# EasyEDA Pro project 主控底板.eprj, schematic TMS320F28335_v2

## Sheets
1 coreboard: Board Name: TMS320F28335; Create Date: 2025-04-28; Page Name: coreboard; Project Name: 主控底板; Schematic Name: TMS320F28335; Update Date: 2025-06-09; Company: 嘉立创EDA; Page Size: A4; Version: V1.0
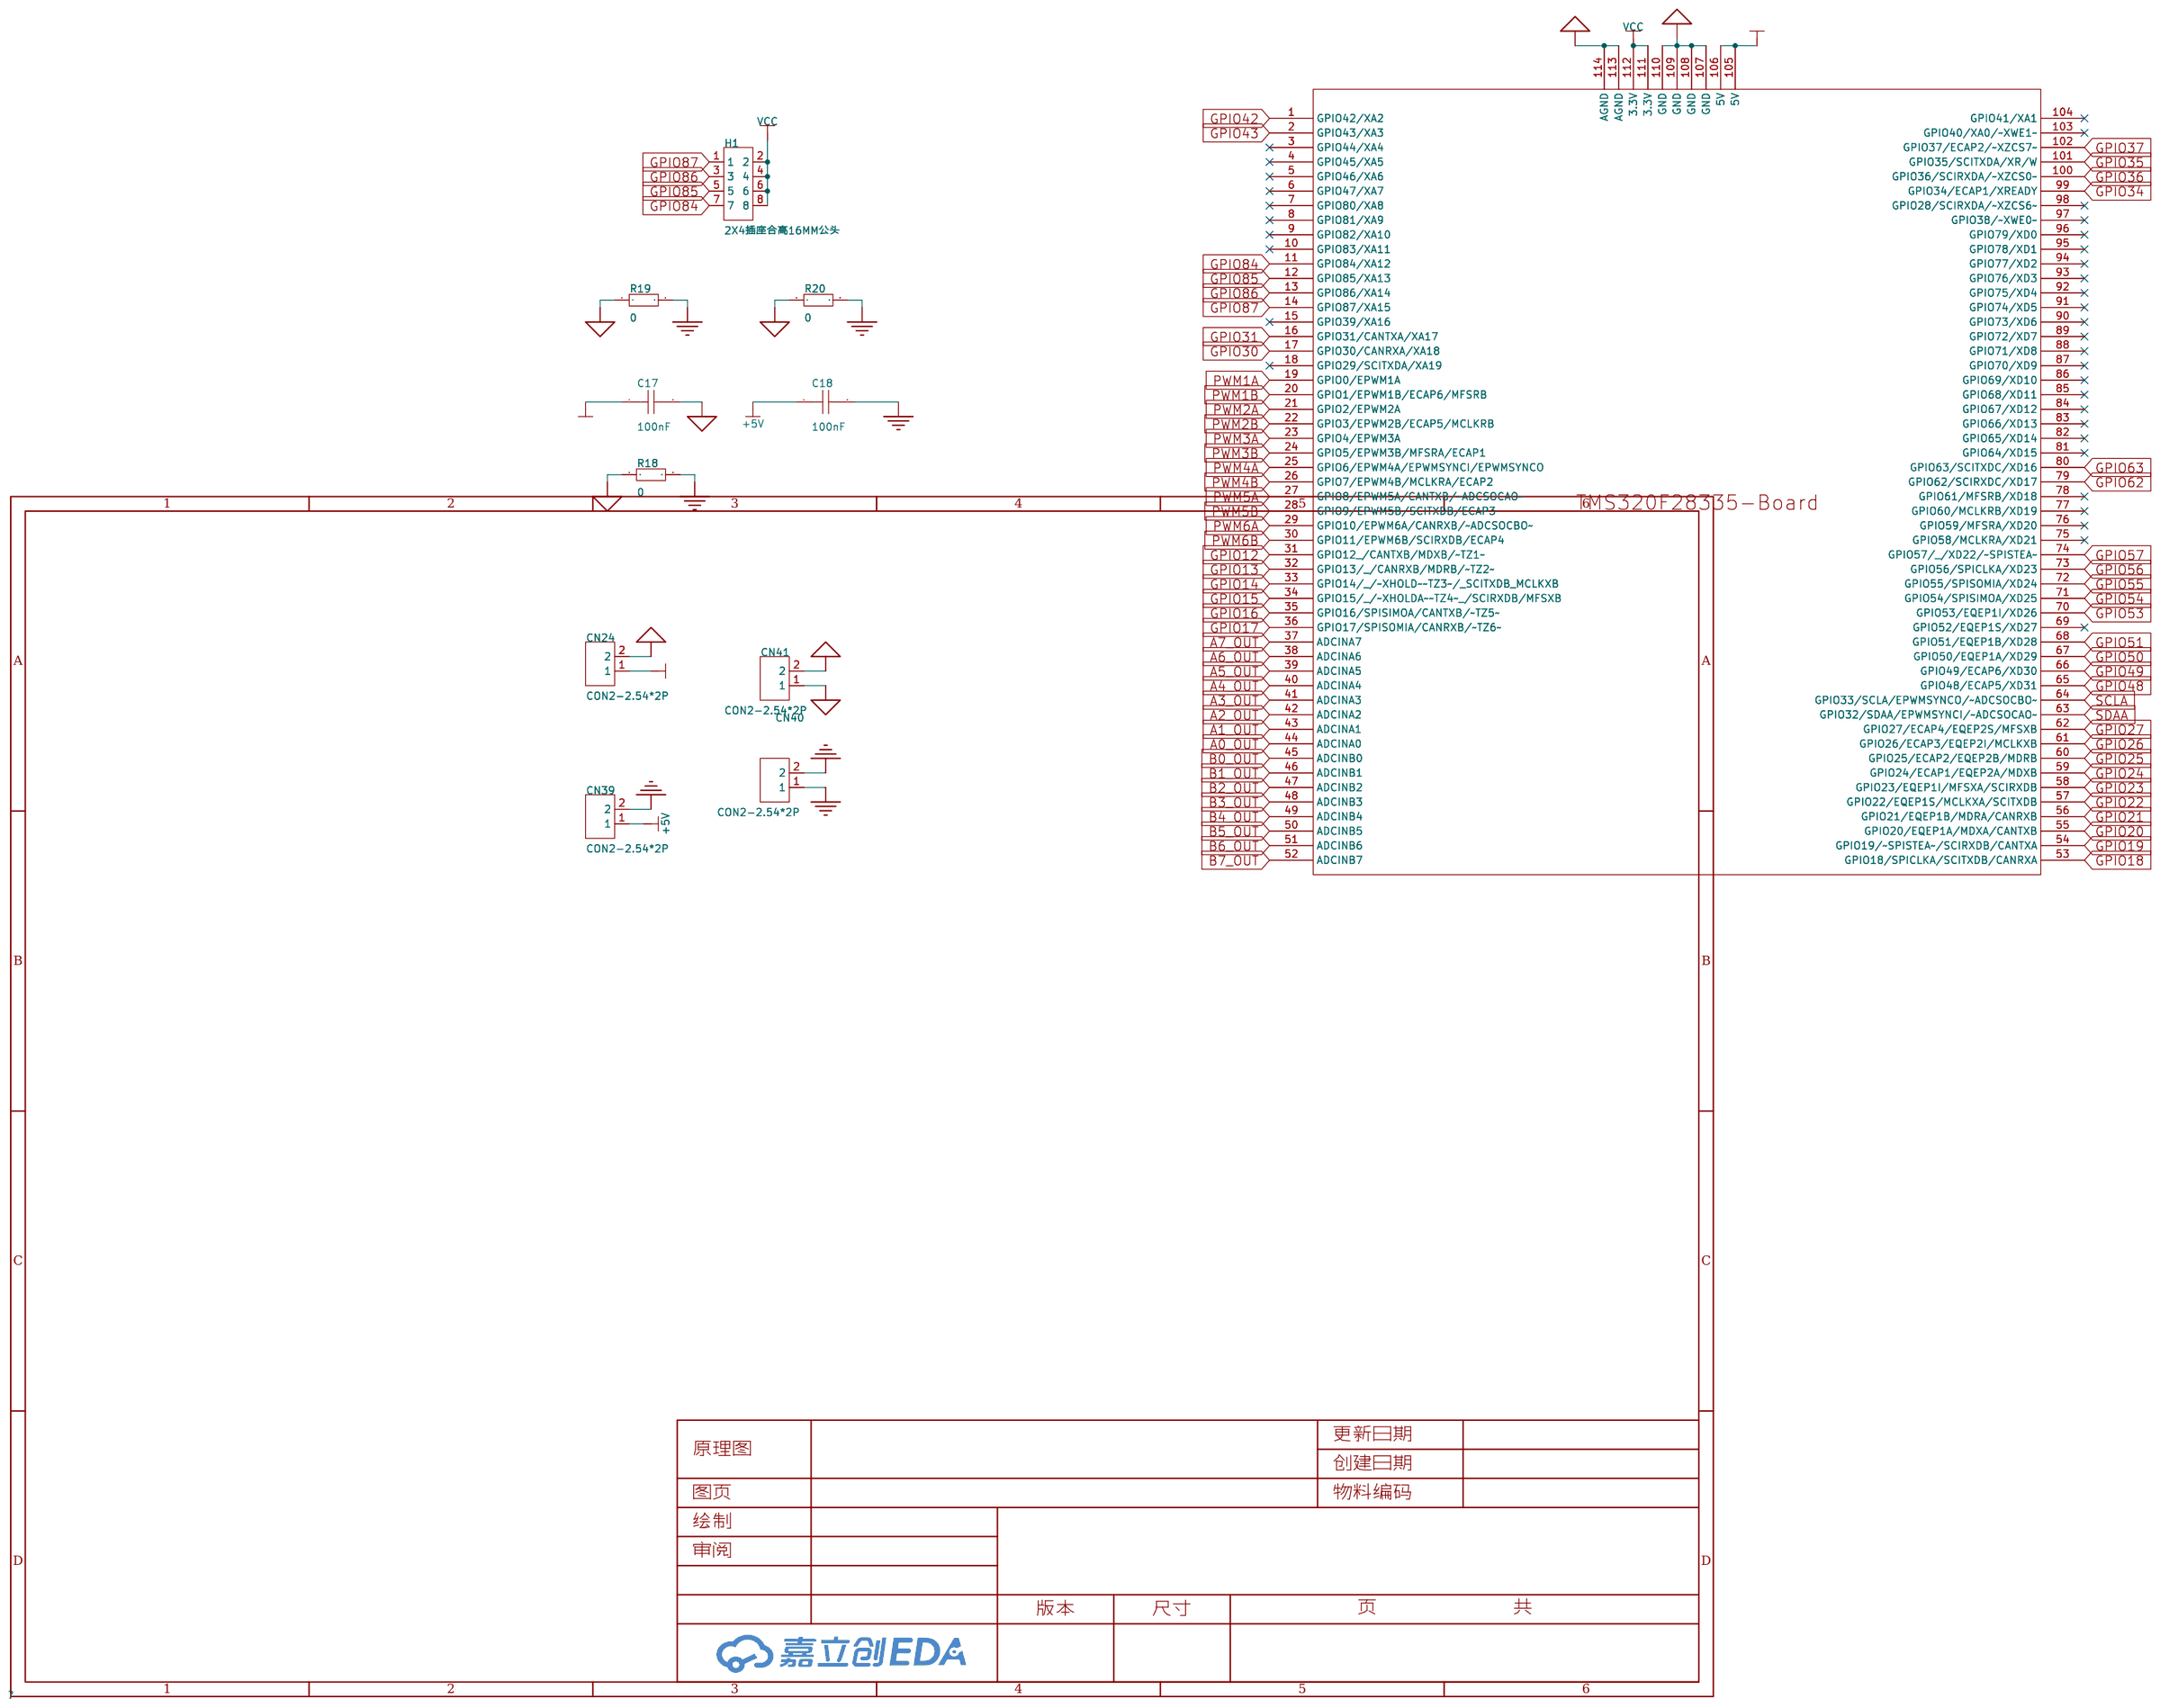
[diagram p3: coreboard]
2 adc: Board Name: TMS320F28335_v2; Create Date: 2025-08-24; Page Name: adc; Schematic Name: TMS320F28335_v2; Update Date: 2025-08-24
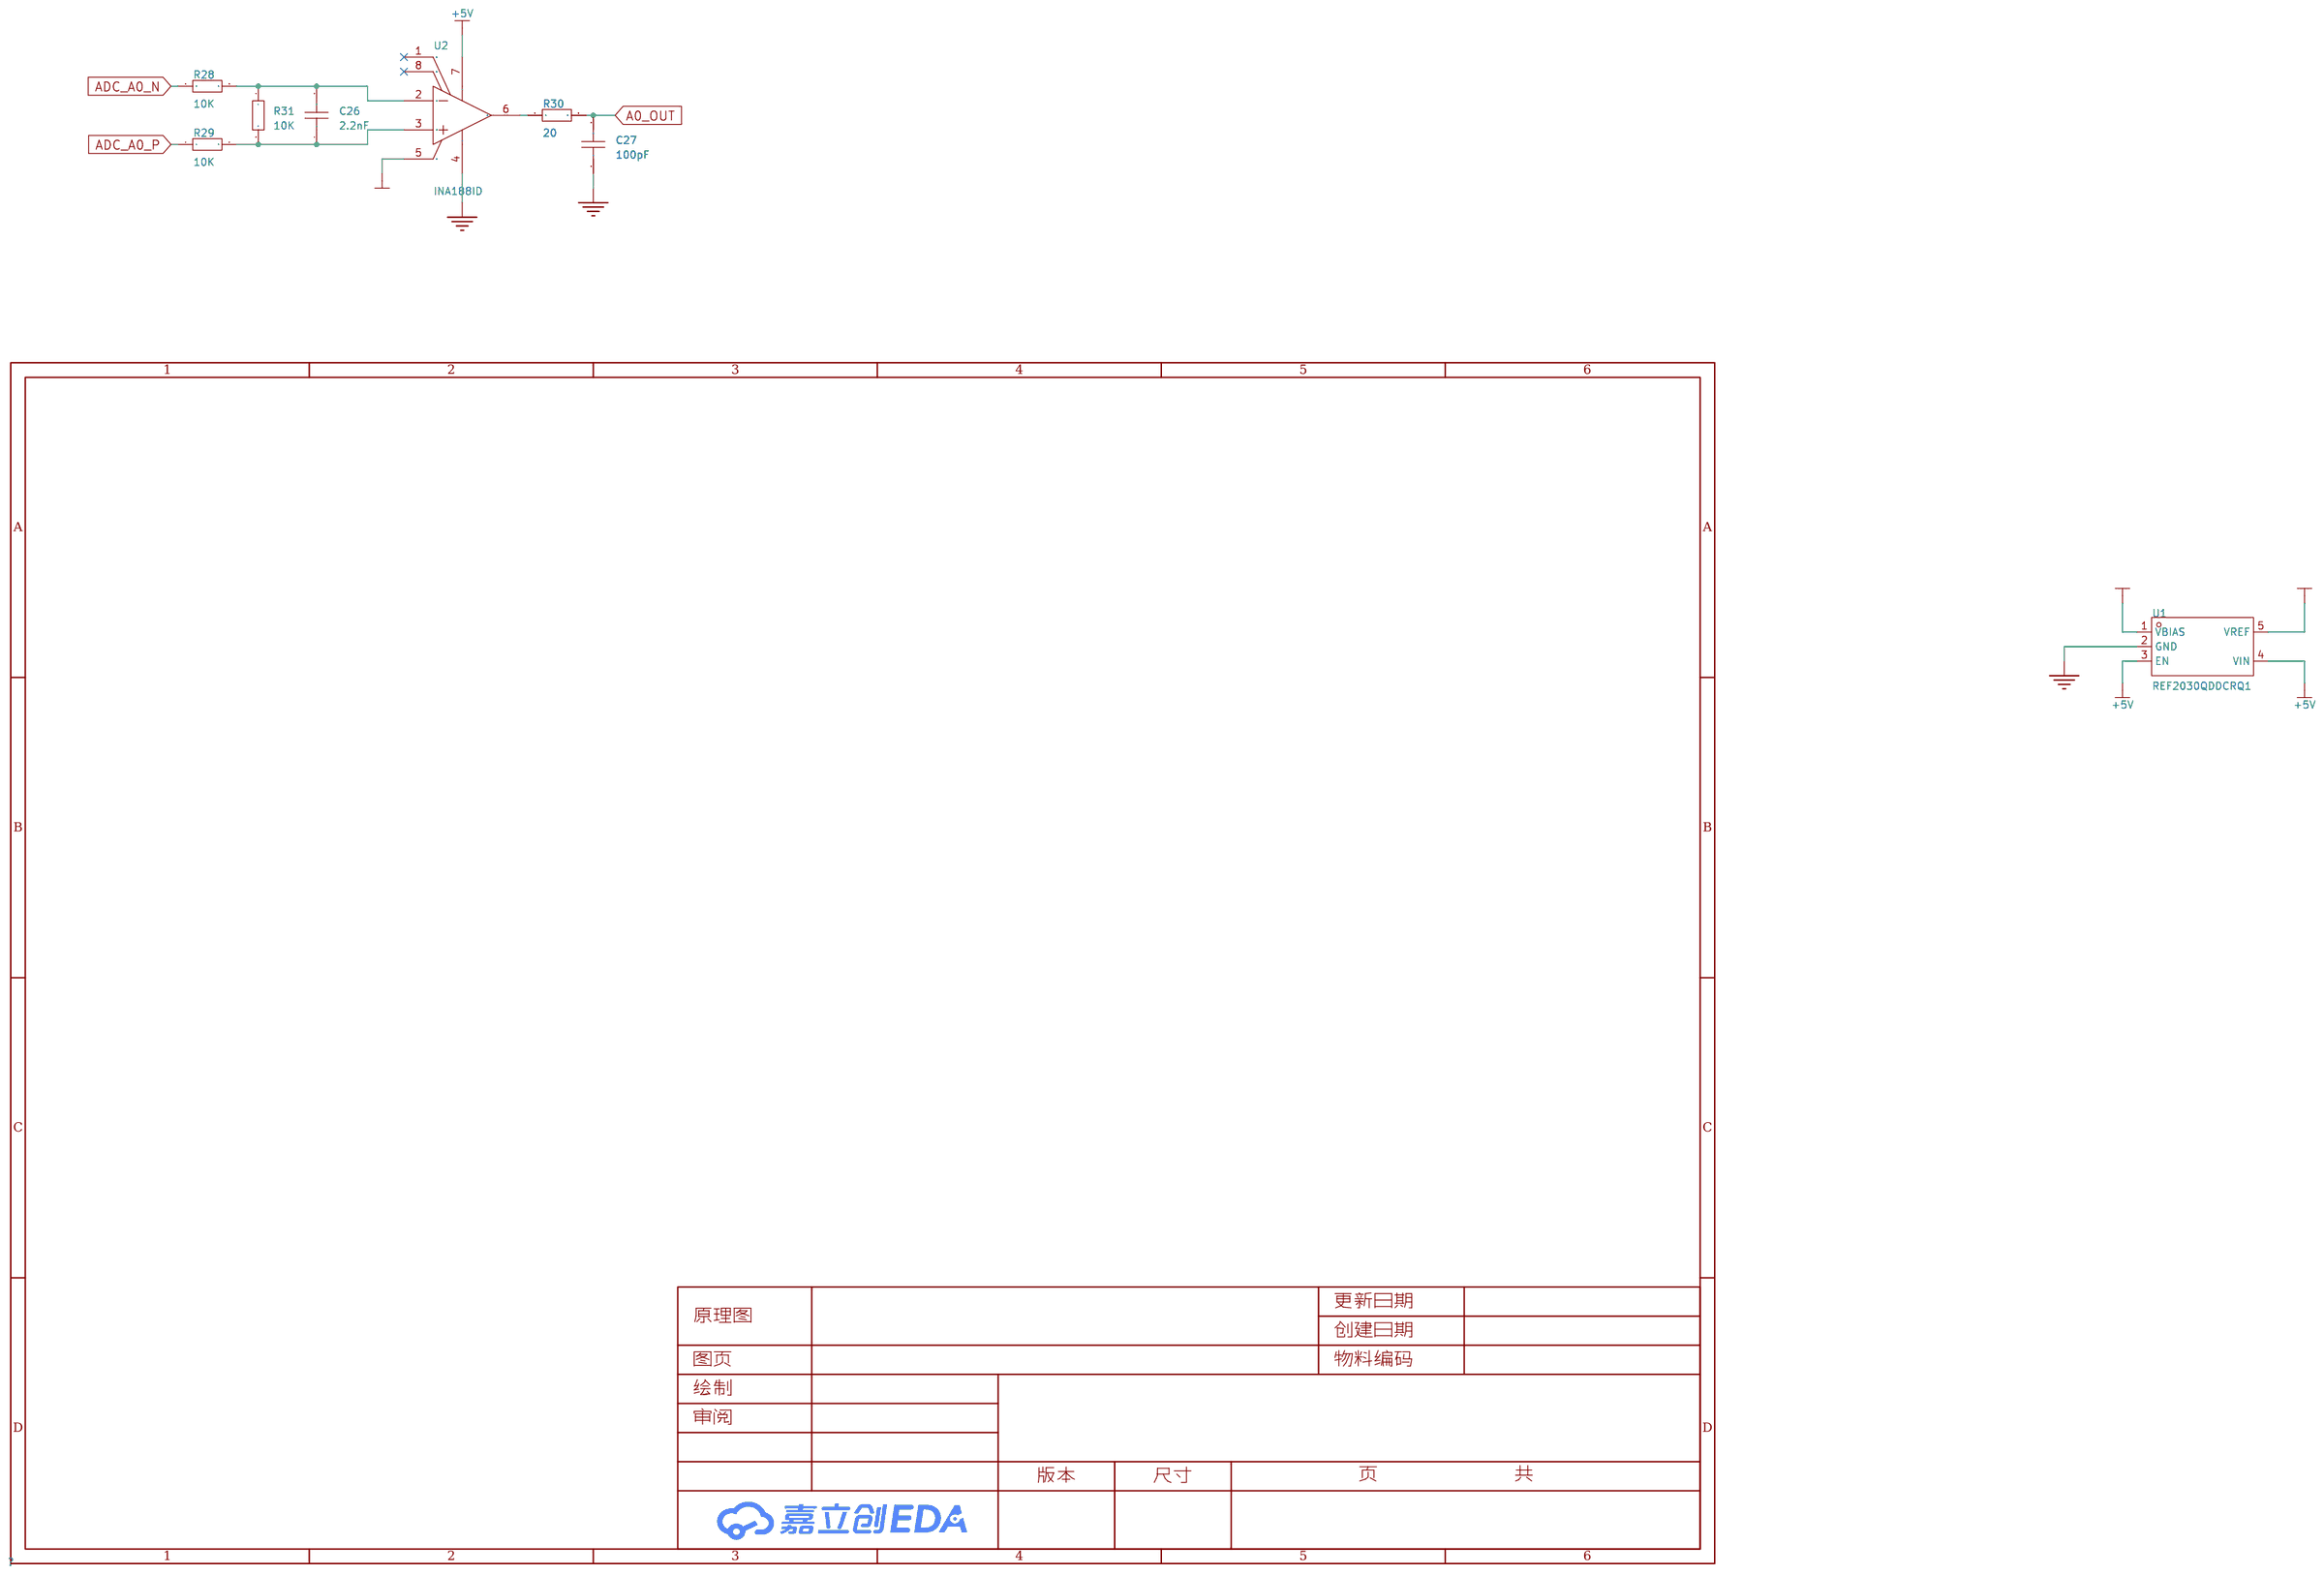
[diagram p4: adc]
3 gpio: Create Date: 2025-05-22
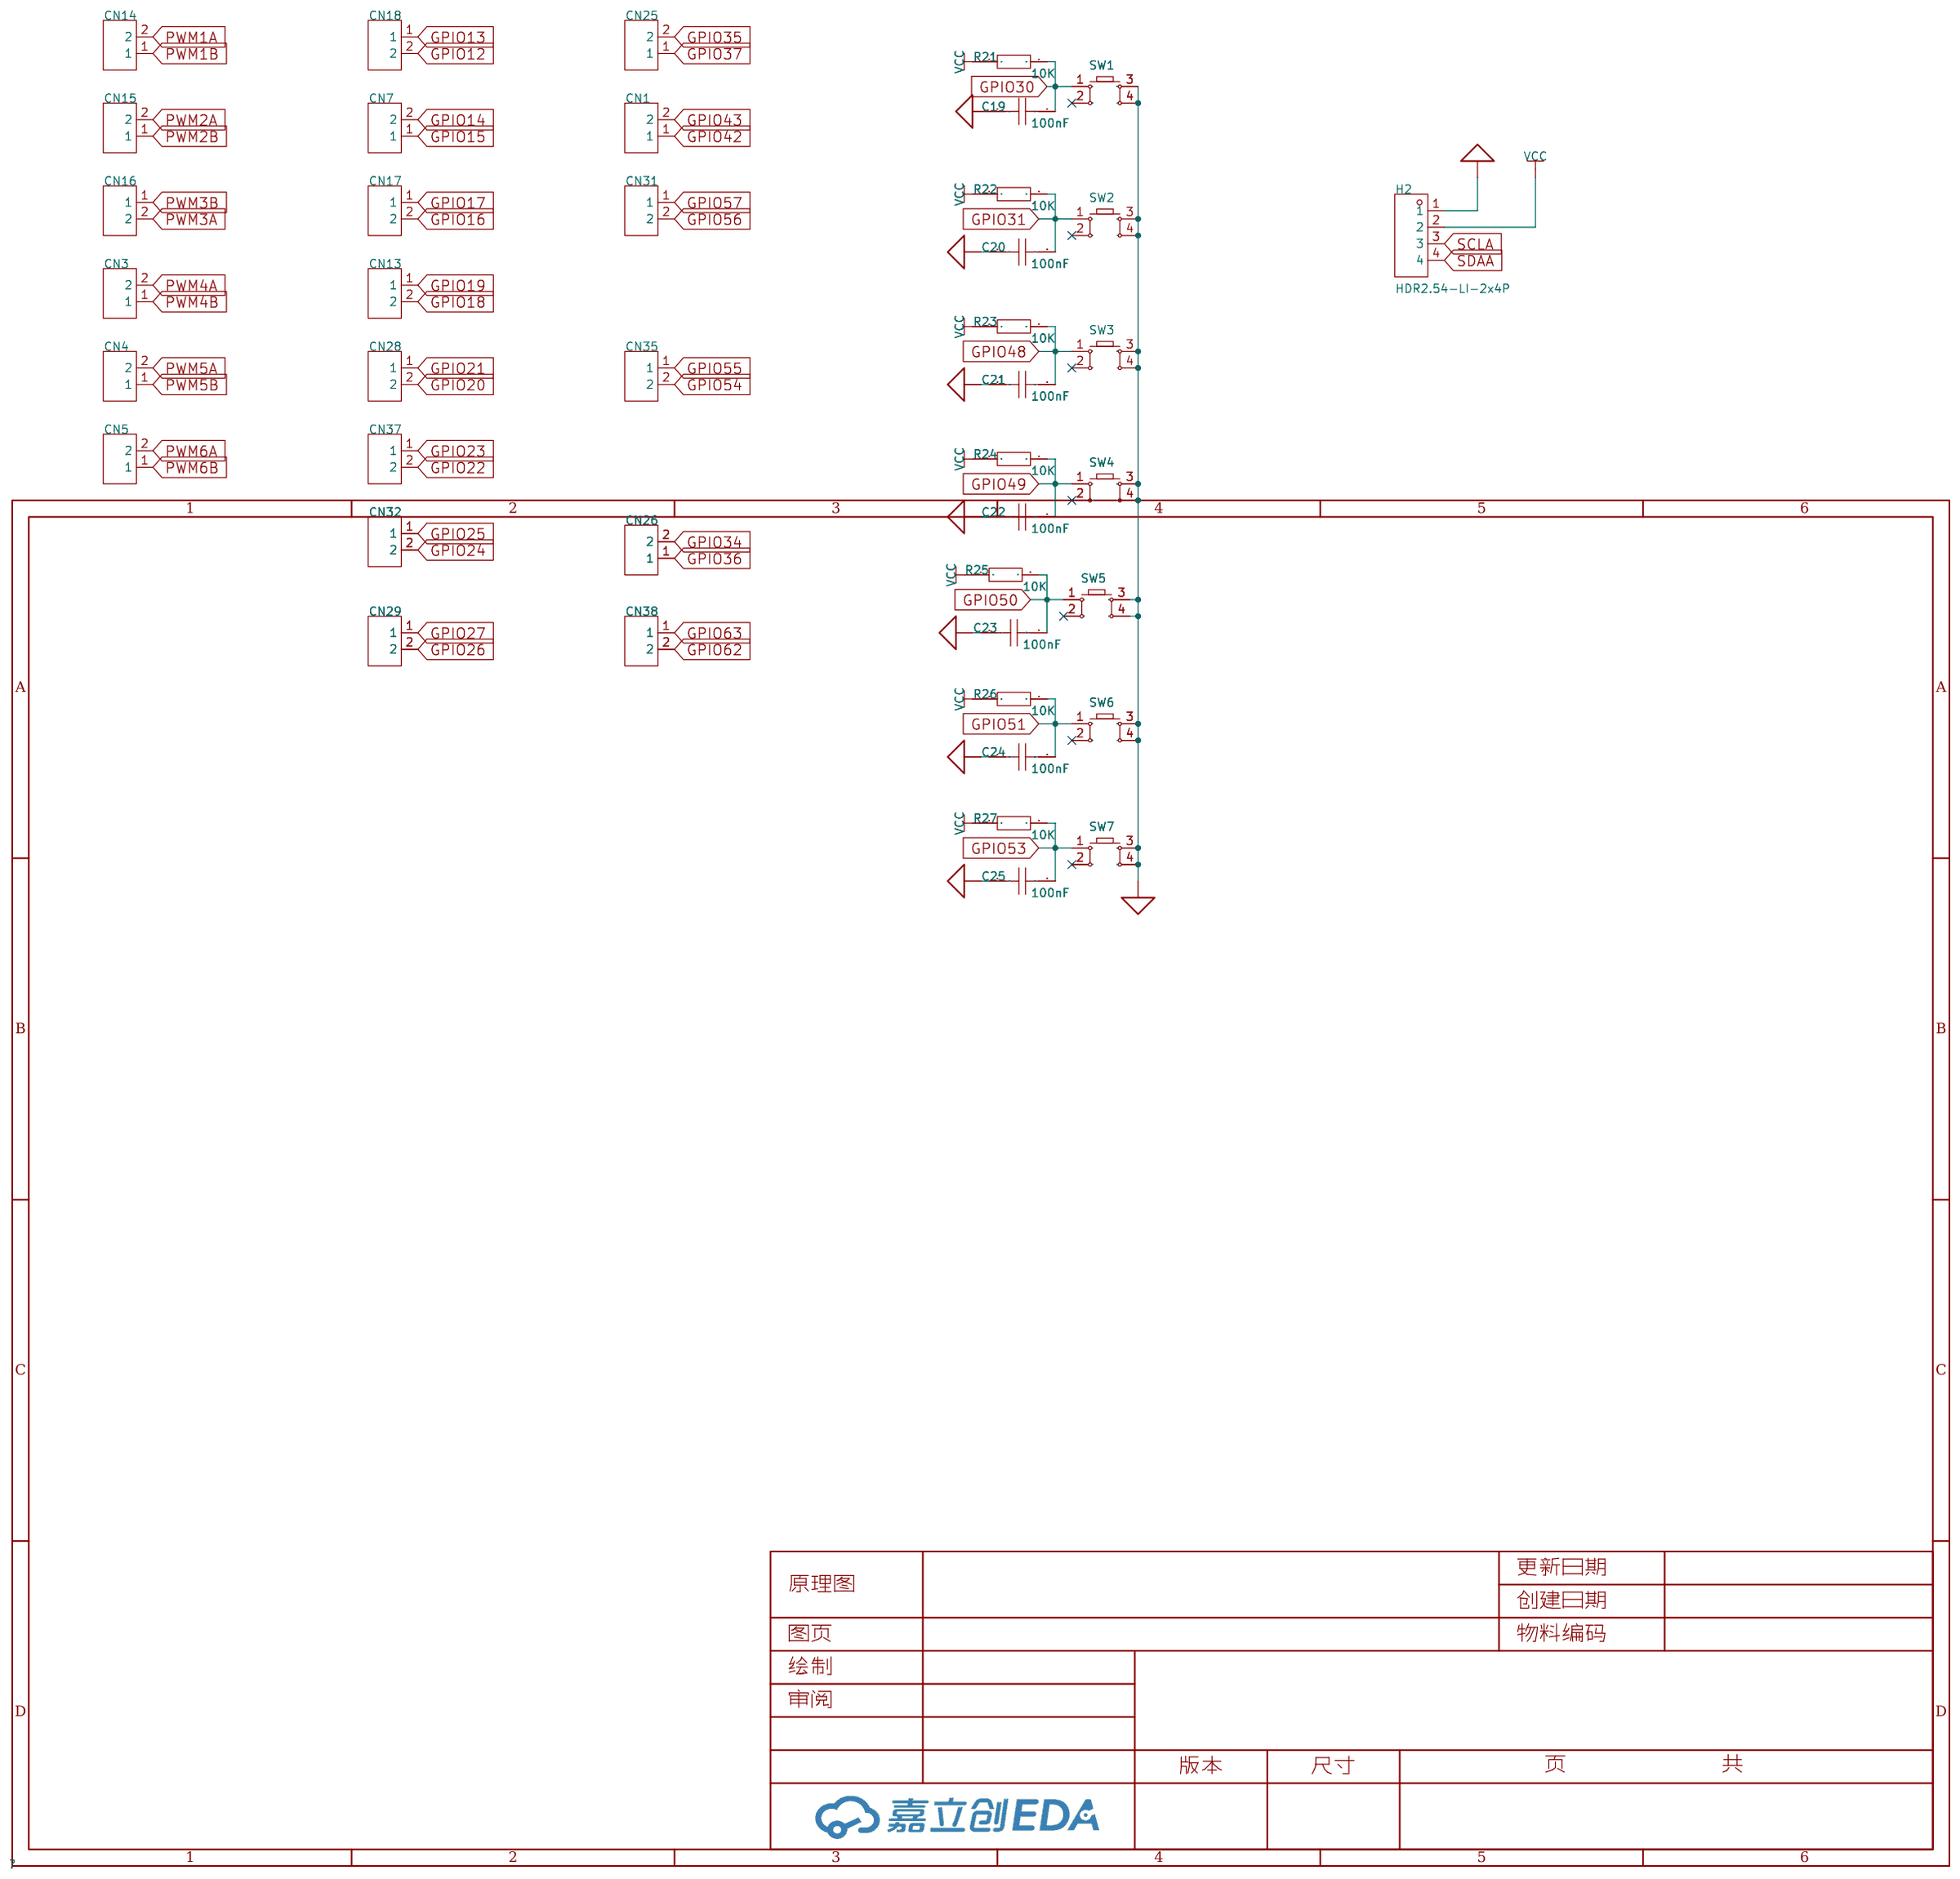
[diagram p5: gpio]

## Parts
sheet adc
C26  2.2nF  [C0805]
C27  100pF  [C0805]
R28  10K  [R0805]
R29  10K  [R0805]
R30  20  [R0805]
R31  10K  [R0805]
U1  REF2030QDDCRQ1  [SOT-23-5_L2.9-W1.6-P0.95-LS2.8-BL]
U2  INA188ID  [SOIC-8_L4.9-W3.9-P1.27-LS6.0-BL]
sheet coreboard
C17  100nF  [C0805]
C18  100nF  [C0805]
CN24  CON2-2.54*2P  [CONN-TH_2P-P2.54-V]
CN39  CON2-2.54*2P  [CONN-TH_2P-P2.54-V]
CN40  CON2-2.54*2P  [CONN-TH_2P-P2.54-V]
CN41  CON2-2.54*2P  [CONN-TH_2P-P2.54-V]
H1  2X4插座合高16MM公头  [HDR-TH_8P-P2.54-V-M-R2-C4-S2.54-2]
R18  0  [R0805]
R19  0  [R0805]
R20  0  [R0805]
TMS320F?#2  TMS320F28335_Board  [TMS320F28335]
sheet gpio
C19  100nF  [C0805]
C20  100nF  [C0805]
C21  100nF  [C0805]
C22  100nF  [C0805]
C23  100nF  [C0805]
C24  100nF  [C0805]
C25  100nF  [C0805]
CN1  CON2-2.54*2P  [CONN-TH_2P-P2.54-V]
CN3  CON2-2.54*2P  [CONN-TH_2P-P2.54-V]
CN4  CON2-2.54*2P  [CONN-TH_2P-P2.54-V]
CN5  CON2-2.54*2P  [CONN-TH_2P-P2.54-V]
CN7  CON2-2.54*2P  [CONN-TH_2P-P2.54-V]
CN13  CON2-2.54*2P  [CONN-TH_2P-P2.54-V]
CN14  CON2-2.54*2P  [CONN-TH_2P-P2.54-V]
CN15  CON2-2.54*2P  [CONN-TH_2P-P2.54-V]
CN16  CON2-2.54*2P  [CONN-TH_2P-P2.54-V]
CN17  CON2-2.54*2P  [CONN-TH_2P-P2.54-V]
CN18  CON2-2.54*2P  [CONN-TH_2P-P2.54-V]
CN25  CON2-2.54*2P  [CONN-TH_2P-P2.54-V]
CN26  CON2-2.54*2P  [CONN-TH_2P-P2.54-V]
CN28  CON2-2.54*2P  [CONN-TH_2P-P2.54-V]
CN29  CON2-2.54*2P  [CONN-TH_2P-P2.54-V]
CN31  CON2-2.54*2P  [CONN-TH_2P-P2.54-V]
CN32  CON2-2.54*2P  [CONN-TH_2P-P2.54-V]
CN35  CON2-2.54*2P  [CONN-TH_2P-P2.54-V]
CN37  CON2-2.54*2P  [CONN-TH_2P-P2.54-V]
CN38  CON2-2.54*2P  [CONN-TH_2P-P2.54-V]
H2  HDR2.54-LI-2x4P  [HDR-TH_4P-P2.54-V-M]
R21  10K  [R0805]
R22  10K  [R0805]
R23  10K  [R0805]
R24  10K  [R0805]
R25  10K  [R0805]
R26  10K  [R0805]
R27  10K  [R0805]
SW1  -  [SW-SMD_4P-L6.0-W6.0-P4.50-LS9.0-2]
SW2  -  [SW-SMD_4P-L6.0-W6.0-P4.50-LS9.0-2]
SW3  -  [SW-SMD_4P-L6.0-W6.0-P4.50-LS9.0-2]
SW4  -  [SW-SMD_4P-L6.0-W6.0-P4.50-LS9.0-2]
SW5  -  [SW-SMD_4P-L6.0-W6.0-P4.50-LS9.0-2]
SW6  -  [SW-SMD_4P-L6.0-W6.0-P4.50-LS9.0-2]
SW7  -  [SW-SMD_4P-L6.0-W6.0-P4.50-LS9.0-2]

## Library data of the parts
C17-C27 = CAP_0805: Supplier Footprint: 0805
R18-R31 = Res_0805: Supplier Footprint: 0805
U1 = REF2030QDDCRQ1: Supplier Part: C3680843; Manufacturer: TI(德州仪器); Supplier Footprint: SOT-23-5; JLCPCB Part Class: 扩展库; Datasheet: https://www.ti.com/cn/lit/gpn/ref20-q1; Supplier: LCSC; Output Type: 固定; Input Voltage: 2.28V~5.5V; Output Voltage: 1.5V；3V; Output Current: 20mA; Tolerance: ±0.05%; Temperature Coefficient: 8ppm/℃; Reference Type: 串联; Supply Current: 460uA; Noise - 1/10Hz to 10Hz: 12ppmp-p; Operating Temperature: -40℃~+125℃
U2 = INA188ID: Supplier Part: C1347387; Manufacturer: TI(德州仪器); Supplier Footprint: SOIC-8; JLCPCB Part Class: 扩展库; Datasheet: https://www.ti.com/cn/lit/gpn/ina188; Supplier: LCSC; Number of Circuits: 单路; Current - Input Bias(Ib): 850pA; Voltage - Input Offset(Vos): 25uV; Slew Rate(SR): 0.9V/us; -3db Bandwidth(G=1): 600kHz; Operating Temperature: -40℃~+125℃
CN1 CN3-CN5 CN7 CN13-CN18 CN24-CN26 CN28 CN29 CN31 CN32 CN35 CN37-CN41 = CON2-2.54*2P: Supplier Part: C9900003238; Supplier Footprint: TH-2P; JLCPCB Part Class: Extended Part; Supplier: LCSC
H1 = 2X4插座合高16MM公头: Supplier Part: C9900022742; Supplier Footprint: HDR-TH_8P-P2.54-V-M; JLCPCB Part Class: 扩展库; Supplier: LCSC
TMS320F?#2 = TMS320F28335_Board
H2 = HDR2.54-LI-2x4P: Supplier Part: C9900020145; JLCPCB Part Class: 扩展库; Supplier: LCSC
SW1-SW7 = Key_SMD_6x6x6.5: Supplier Footprint: SMD

## Nets
+1.5V: U1.1(VBIAS) U2.5(REF)
+3V: U1.5(VREF)
+5V: C18.1 CN39.1 U1.3(EN) U1.4(VIN) U2.7(V+)
+5V_D: C17.1 CN24.1 TMS320F?#2.105(5V) TMS320F?#2.106(5V)
AGND: C17.2 C19.1 C20.1 C21.1 C22.1 C23.1 C24.1 C25.1 CN24.2 CN41.1 CN41.2 H2.1 R18.1 R19.1 R20.1 SW1.3 SW1.4 SW2.3 SW2.4 SW3.3 SW3.4 SW4.3 SW4.4 SW5.3 SW5.4 SW6.3 SW6.4 SW7.3 SW7.4 TMS320F?#2.107(GND) TMS320F?#2.108(GND) TMS320F?#2.109(GND) TMS320F?#2.110(GND) TMS320F?#2.113(AGND) TMS320F?#2.114(AGND)
GND: C18.2 C27.1 CN39.2 CN40.1 CN40.2 R18.2 R19.2 R20.2 U1.2(GND) U2.4(V-)
VCC: H1.2 H1.4 H1.6 H1.8 H2.2 R21.1 R22.1 R23.1 R24.1 R25.1 R26.1 R27.1 TMS320F?#2.111(3.3V) TMS320F?#2.112(3.3V)
A0_OUT: C27.2 R30.2 TMS320F?#2.44(ADCINA0)
A1_OUT: TMS320F?#2.43(ADCINA1)
A2_OUT: TMS320F?#2.42(ADCINA2)
A3_OUT: TMS320F?#2.41(ADCINA3)
A4_OUT: TMS320F?#2.40(ADCINA4)
A5_OUT: TMS320F?#2.39(ADCINA5)
A6_OUT: TMS320F?#2.38(ADCINA6)
A7_OUT: TMS320F?#2.37(ADCINA7)
ADC_A0_N: R28.1
ADC_A0_P: R29.1
B0_OUT: TMS320F?#2.45(ADCINB0)
B1_OUT: TMS320F?#2.46(ADCINB1)
B2_OUT: TMS320F?#2.47(ADCINB2)
B3_OUT: TMS320F?#2.48(ADCINB3)
B4_OUT: TMS320F?#2.49(ADCINB4)
B5_OUT: TMS320F?#2.50(ADCINB5)
B6_OUT: TMS320F?#2.51(ADCINB6)
B7_OUT: TMS320F?#2.52(ADCINB7)
GPIO12: CN18.2 TMS320F?#2.31(GPIO12 /CANTXB/MDXB/~TZ1~)
GPIO13: CN18.1 TMS320F?#2.32(GPIO13/ /CANRXB/MDRB/~TZ2~)
GPIO14: CN7.2 TMS320F?#2.33(GPIO14/ /~XHOLD~~TZ3~/ SCITXDB MCLKXB)
GPIO15: CN7.1 TMS320F?#2.34(GPIO15/ /~XHOLDA~~TZ4~ /SCIRXDB/MFSXB)
GPIO16: CN17.2 TMS320F?#2.35(GPIO16/SPISIMOA/CANTXB/~TZ5~)
GPIO17: CN17.1 TMS320F?#2.36(GPIO17/SPISOMIA/CANRXB/~TZ6~)
GPIO18: CN13.2 TMS320F?#2.53(GPIO18/SPICLKA/SCITXDB/CANRXA)
GPIO19: CN13.1 TMS320F?#2.54(GPIO19/~SPISTEA~/SCIRXDB/CANTXA)
GPIO20: CN28.2 TMS320F?#2.55(GPIO20/EQEP1A/MDXA/CANTXB)
GPIO21: CN28.1 TMS320F?#2.56(GPIO21/EQEP1B/MDRA/CANRXB)
GPIO22: CN37.2 TMS320F?#2.57(GPIO22/EQEP1S/MCLKXA/SCITXDB)
GPIO23: CN37.1 TMS320F?#2.58(GPIO23/EQEP1I/MFSXA/SCIRXDB)
GPIO24: CN32.2 TMS320F?#2.59(GPIO24/ECAP1/EQEP2A/MDXB)
GPIO25: CN32.1 TMS320F?#2.60(GPIO25/ECAP2/EQEP2B/MDRB)
GPIO26: CN29.2 TMS320F?#2.61(GPIO26/ECAP3/EQEP2I/MCLKXB)
GPIO27: CN29.1 TMS320F?#2.62(GPIO27/ECAP4/EQEP2S/MFSXB)
GPIO30: C19.2 R21.2 SW1.1 TMS320F?#2.17(GPIO30/CANRXA/XA18)
GPIO31: C20.2 R22.2 SW2.1 TMS320F?#2.16(GPIO31/CANTXA/XA17)
GPIO34: CN26.2 TMS320F?#2.99(GPIO34/ECAP1/XREADY)
GPIO35: CN25.2 TMS320F?#2.101(GPIO35/SCITXDA/XR/W)
GPIO36: CN26.1 TMS320F?#2.100(GPIO36/SCIRXDA/~XZCS0~)
GPIO37: CN25.1 TMS320F?#2.102(GPIO37/ECAP2/~XZCS7~)
GPIO42: CN1.1 TMS320F?#2.1(GPIO42/XA2)
GPIO43: CN1.2 TMS320F?#2.2(GPIO43/XA3)
GPIO48: C21.2 R23.2 SW3.1 TMS320F?#2.65(GPIO48/ECAP5/XD31)
GPIO49: C22.2 R24.2 SW4.1 TMS320F?#2.66(GPIO49/ECAP6/XD30)
GPIO50: C23.2 R25.2 SW5.1 TMS320F?#2.67(GPIO50/EQEP1A/XD29)
GPIO51: C24.2 R26.2 SW6.1 TMS320F?#2.68(GPIO51/EQEP1B/XD28)
GPIO53: C25.2 R27.2 SW7.1 TMS320F?#2.70(GPIO53/EQEP1I/XD26)
GPIO54: CN35.2 TMS320F?#2.71(GPIO54/SPISIMOA/XD25)
GPIO55: CN35.1 TMS320F?#2.72(GPIO55/SPISOMIA/XD24)
GPIO56: CN31.2 TMS320F?#2.73(GPIO56/SPICLKA/XD23)
GPIO57: CN31.1 TMS320F?#2.74(GPIO57/ /XD22/~SPISTEA~)
GPIO62: CN38.2 TMS320F?#2.79(GPIO62/SCIRXDC/XD17)
GPIO63: CN38.1 TMS320F?#2.80(GPIO63/SCITXDC/XD16)
GPIO84: H1.7 TMS320F?#2.11(GPIO84/XA12)
GPIO85: H1.5 TMS320F?#2.12(GPIO85/XA13)
GPIO86: H1.3 TMS320F?#2.13(GPIO86/XA14)
GPIO87: H1.1 TMS320F?#2.14(GPIO87/XA15)
PWM1A: CN14.2 TMS320F?#2.19(GPIO0/EPWM1A)
PWM1B: CN14.1 TMS320F?#2.20(GPIO1/EPWM1B/ECAP6/MFSRB)
PWM2A: CN15.2 TMS320F?#2.21(GPIO2/EPWM2A)
PWM2B: CN15.1 TMS320F?#2.22(GPIO3/EPWM2B/ECAP5/MCLKRB)
PWM3A: CN16.2 TMS320F?#2.23(GPIO4/EPWM3A)
PWM3B: CN16.1 TMS320F?#2.24(GPIO5/EPWM3B/MFSRA/ECAP1)
PWM4A: CN3.2 TMS320F?#2.25(GPIO6/EPWM4A/EPWMSYNCI/EPWMSYNCO)
PWM4B: CN3.1 TMS320F?#2.26(GPIO7/EPWM4B/MCLKRA/ECAP2)
PWM5A: CN4.2 TMS320F?#2.27(GPIO8/EPWM5A/CANTXB/~ADCSOCAO~)
PWM5B: CN4.1 TMS320F?#2.28(GPIO9/EPWM5B/SCITXDB/ECAP3)
PWM6A: CN5.2 TMS320F?#2.29(GPIO10/EPWM6A/CANRXB/~ADCSOCBO~)
PWM6B: CN5.1 TMS320F?#2.30(GPIO11/EPWM6B/SCIRXDB/ECAP4)
SCLA: H2.3 TMS320F?#2.64(GPIO33/SCLA/EPWMSYNCO/~ADCSOCBO~)
SDAA: H2.4 TMS320F?#2.63(GPIO32/SDAA/EPWMSYNCI/~ADCSOCAO~)
Net-(C26-1): C26.1 R29.2 R31.2 U2.3(VIN+)
Net-(C26-2): C26.2 R28.2 R31.1 U2.2(VIN-)
Net-(R30-1): R30.1 U2.6(VOUT)

Not connected (* = marked no-connect by the designer): SW1 2*; SW2 2*; SW3 2*; SW4 2*; SW5 2*; SW6 2*; SW7 2*; TMS320F?#2 3(GPIO44/XA4)* 4(GPIO45/XA5)* 5(GPIO46/XA6)* 6(GPIO47/XA7)* 7(GPIO80/XA8)* 8(GPIO81/XA9)* 9(GPIO82/XA10)* 10(GPIO83/XA11)* 15(GPIO39/XA16)* 18(GPIO29/SCITXDA/XA19)* 69(GPIO52/EQEP1S/XD27)* 75(GPIO58/MCLKRA/XD21)* 76(GPIO59/MFSRA/XD20)* 77(GPIO60/MCLKRB/XD19)* 78(GPIO61/MFSRB/XD18)* 81(GPIO64/XD15)* 82(GPIO65/XD14)* 83(GPIO66/XD13)* 84(GPIO67/XD12)* 85(GPIO68/XD11)* 86(GPIO69/XD10)* 87(GPIO70/XD9)* 88(GPIO71/XD8)* 89(GPIO72/XD7)* 90(GPIO73/XD6)* 91(GPIO74/XD5)* 92(GPIO75/XD4)* 93(GPIO76/XD3)* 94(GPIO77/XD2)* 95(GPIO78/XD1)* 96(GPIO79/XD0)* 97(GPIO38/~XWE0~)* 98(GPIO28/SCIRXDA/~XZCS6~)* 103(GPIO40/XA0/~XWE1~)* 104(GPIO41/XA1)*; U2 1(RG)* 8(RG)*
